# Altium schematic sheet GTM_MCU.SchDoc
size A4
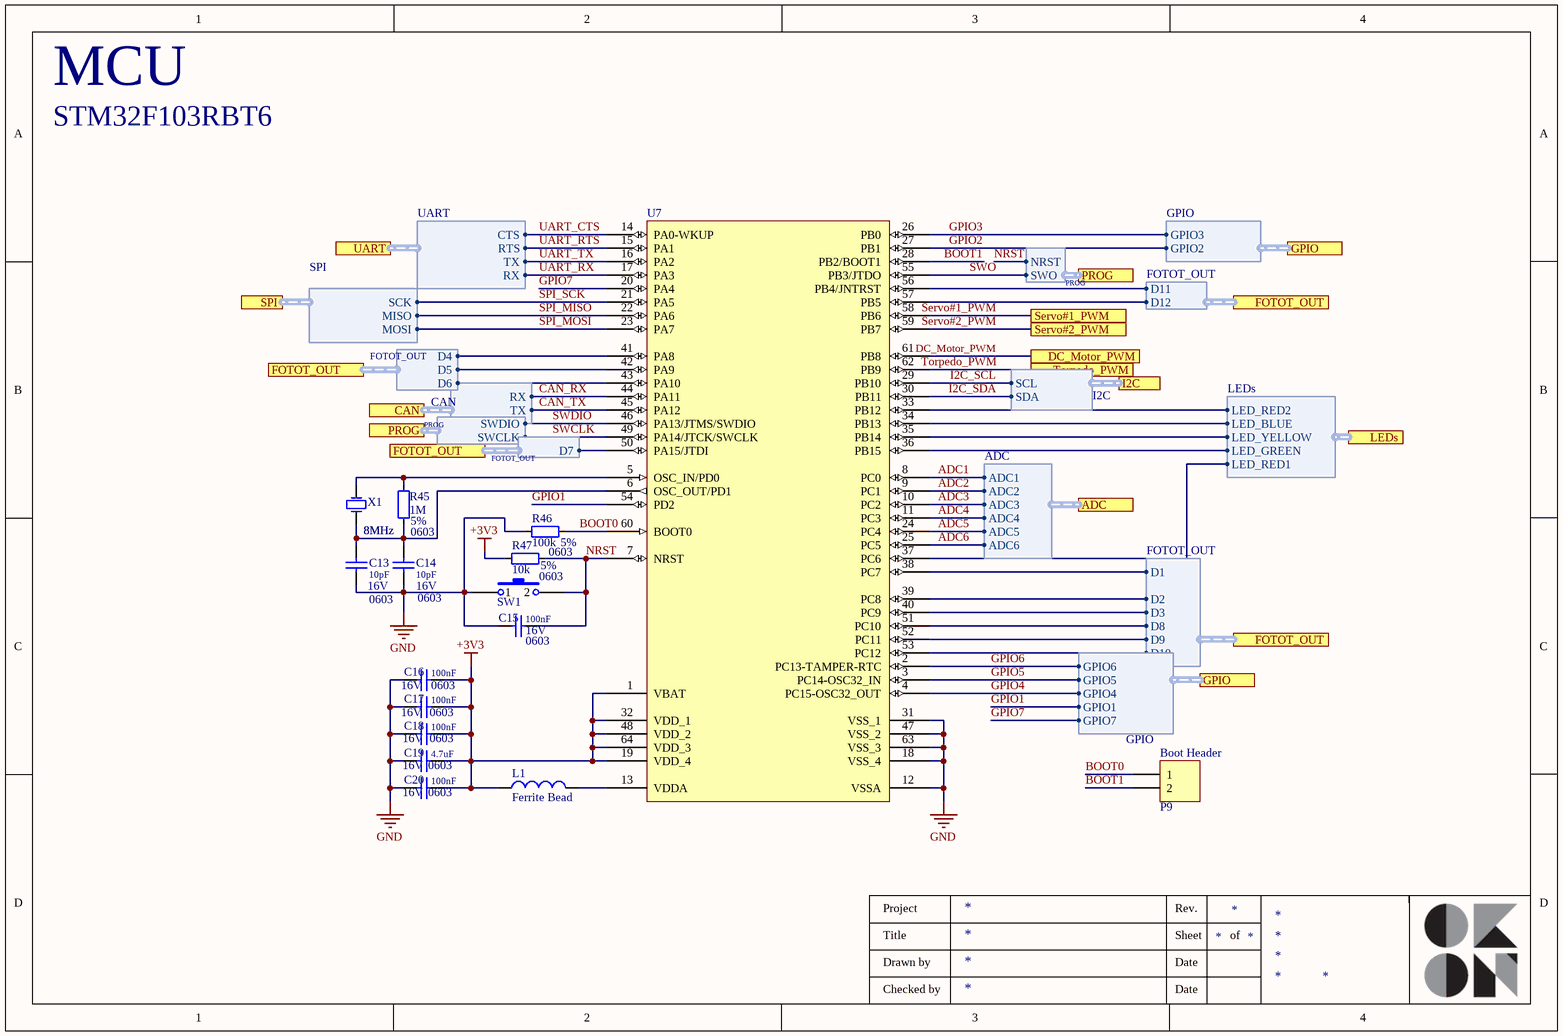
[diagram p0: GTM_MCU.SchDoc]

## Parts
C13  value 10pF  Capacity: 16V  Package: 0603  [0603_CAP]  (hidden comment: Cap)
C14  value 10pF  Capacity: 16V  Package: 0603  [0603_CAP]  (hidden comment: Cap)
C15  value 100nF  Capacity: 16V  Package: 0603  [0603_CAP]  (hidden comment: Cap)
C16  value 100nF  Capacity: 16V  Package: 0603  [0603_CAP]  (hidden comment: Cap)
C17  value 100nF  Capacity: 16V  Package: 0603  [0603_CAP]  (hidden comment: Cap)
C18  value 100nF  Capacity: 16V  Package: 0603  [0603_CAP]  (hidden comment: Cap)
C19  value 4.7uF  Capacity: 16V  Package: 0603  [0603_CAP]  (hidden comment: Cap)
C20  value 100nF  Capacity: 16V  Package: 0603  [0603_CAP]  (hidden comment: Cap)
L1  Ferrite Bead  [DO5040]
P9  Boot Header  [HDR1X2]
R45  Tolerance: 5%  [0603]  (hidden comment: 1M)
R46  Tolerance: 5%  [0603]  (hidden comment: 100k)
R47  Tolerance: 5%  [0603]  (hidden comment: 10k)
SW1  Micro_Switch  [Tact 34N-F]  (value not drawn)
U7  STM32F103RBT6  [LQFP64_L]  (value not drawn)
X1  8MHz  [HC49/4H_SMX]

## Ports
ADC (harness ADC), CAN (harness CAN), DC_Motor_PWM, FOTOT_OUT (harness FOTOT_OUT), GPIO (harness GPIO), I2C (harness I2C), LEDs (harness LEDs), PROG (harness PROG), Servo#1_PWM, Servo#2_PWM, SPI (harness SPI), Torpedo_PWM, UART (harness UART)

## Harnesses
LEDs: LED_RED1, LED_GREEN, LED_YELLOW, LED_BLUE, LED_RED2
FOTOT_OUT: D1, D2, D3, D8, D9, D10
UART: CTS, RTS, TX, RX
SPI: SCK, MISO, MOSI
CAN: RX, TX
I2C: SCL, SDA
ADC: ADC1, ADC2, ADC3, ADC4, ADC5, ADC6
PROG: SWCLK, SWDIO
PROG: SWO, NRST
GPIO: GPIO4, GPIO5, GPIO6, GPIO1, GPIO7
FOTOT_OUT: D4, D5, D6
FOTOT_OUT: D7
FOTOT_OUT: D12, D11
GPIO: GPIO2, GPIO3

## Nets
+3V3: C16.2 C17.2 C18.2 C19.2 C20.2 L1.1 R47.2 U7.1(VBAT) U7.19(VDD_4) U7.32(VDD_1) U7.48(VDD_2) U7.64(VDD_3)
GND: C13.1 C14.1 C15.1 C16.1 C17.1 C18.1 C19.1 C20.1 R46.2 SW1.1 U7.12(VSSA) U7.18(VSS_4) U7.31(VSS_1) U7.47(VSS_2) U7.63(VSS_3)
ADC1: U7.8(PC0) ; port ADC.ADC1
ADC2: U7.9(PC1) ; port ADC.ADC2
ADC3: U7.10(PC2) ; port ADC.ADC3
ADC4: U7.11(PC3) ; port ADC.ADC4
ADC5: U7.24(PC4) ; port ADC.ADC5
ADC6: U7.25(PC5) ; port ADC.ADC6
BOOT0: P9.1 R46.1 U7.60(BOOT0)
BOOT1: P9.2 U7.28(PB2/BOOT1)
CAN_RX: U7.44(PA11) ; port CAN.RX
CAN_TX: U7.45(PA12) ; port CAN.TX
DC_Motor_PWM: U7.61(PB8) ; port DC_Motor_PWM
GPIO1: U7.54(PD2) ; port GPIO.GPIO1
GPIO2: U7.27(PB1) ; port GPIO.GPIO2
GPIO3: U7.26(PB0) ; port GPIO.GPIO3
GPIO4: U7.4(PC15-OSC32_OUT) ; port GPIO.GPIO4
GPIO5: U7.3(PC14-OSC32_IN) ; port GPIO.GPIO5
GPIO6: U7.2(PC13-TAMPER-RTC) ; port GPIO.GPIO6
GPIO7: U7.20(PA4) ; port GPIO.GPIO7
I2C_SCL: U7.29(PB10) ; port I2C.SCL
I2C_SDA: U7.30(PB11) ; port I2C.SDA
NRST: C15.2 R47.1 SW1.2 U7.7(NRST) ; port PROG.NRST
Servo#1_PWM: U7.58(PB6) ; port Servo#1_PWM
Servo#2_PWM: U7.59(PB7) ; port Servo#2_PWM
SPI_MISO: U7.22(PA6) ; port SPI.MISO
SPI_MOSI: U7.23(PA7) ; port SPI.MOSI
SPI_SCK: U7.21(PA5) ; port SPI.SCK
SWCLK: U7.49(PA14/JTCK/SWCLK) ; port PROG.SWCLK
SWDIO: U7.46(PA13/JTMS/SWDIO) ; port PROG.SWDIO
SWO: U7.55(PB3/JTDO) ; port PROG.SWO
Torpedo_PWM: U7.62(PB9) ; port Torpedo_PWM
UART_CTS: U7.14(PA0-WKUP) ; port UART.CTS
UART_RTS: U7.15(PA1) ; port UART.RTS
UART_RX: U7.17(PA3) ; port UART.RX
UART_TX: U7.16(PA2) ; port UART.TX
NetC13_2: C13.2 C14.2 R45.1 U7.6(OSC_OUT/PD1) X1.1(OSC1)
NetL1_2: L1.2 U7.13(VDDA)
NetR45_2: R45.2 U7.5(OSC_IN/PD0) X1.2(OSC2)
NetU7_33: U7.33(PB12) ; port LEDs.LED_RED2
NetU7_34: U7.34(PB13) ; port LEDs.LED_BLUE
NetU7_35: U7.35(PB14) ; port LEDs.LED_YELLOW
NetU7_36: U7.36(PB15) ; port LEDs.LED_GREEN
NetU7_37: U7.37(PC6) ; port LEDs.LED_RED1
NetU7_38: U7.38(PC7) ; port FOTOT_OUT.D1
NetU7_39: U7.39(PC8) ; port FOTOT_OUT.D2
NetU7_40: U7.40(PC9) ; port FOTOT_OUT.D3
NetU7_41: U7.41(PA8) ; port FOTOT_OUT.D4
NetU7_42: U7.42(PA9) ; port FOTOT_OUT.D5
NetU7_43: U7.43(PA10) ; port FOTOT_OUT.D6
NetU7_50: U7.50(PA15/JTDI) ; port FOTOT_OUT.D7
NetU7_51: U7.51(PC10) ; port FOTOT_OUT.D8
NetU7_52: U7.52(PC11) ; port FOTOT_OUT.D9
NetU7_53: U7.53(PC12) ; port FOTOT_OUT.D10
NetU7_56: U7.56(PB4/JNTRST) ; port FOTOT_OUT.D11
NetU7_57: U7.57(PB5) ; port FOTOT_OUT.D12

## Notes on the sheet
- MCU
- STM32F103RBT6
- Project
- Rev.
- Title
- Drawn by
- Date
- Sheet
- of
- Checked by

## Library data of the parts
C13-C20 = Cap: Ceramic capacitor; Unit Price1: *; Unit Price2: *
L1 = Inductor: DO5040H-103; Code_IEC: 1005; Published: 8-Jun-2000; LatestRevisionDate: 29-May-2009; LatestRevisionNote: IPC-7351 Footprint Added.; PackageReference: 0402-A; Publisher: Altium Limited; PackageDescription: Chip Inductor; Code_JEITA: 0402
P9 = HDR1X2: Header, 2-Pin; LatestRevisionDate: 17-Jul-2002; LatestRevisionNote: Re-released for DXP Platform.; Publisher: Altium Limited
R45-R47 = RES: Resistior; Package: 0603
  R45: Value: 1M
  R46: Value: 100k
  R47: Value: 10k
SW1 = Micro_Switch: Switch; Published: 24-Mar-1999; LatestRevisionDate: 17-Jul-2002; LatestRevisionNote: Re-released for DXP Platform.; PackageReference: SPST-2; Publisher: Altium Limited
U7 = STM32F103RBT6: STM32 ARM-based 32-bit; Published: 30-May-2008; DatasheetVersion: rev6, Mar-2008; PackageVersion: Mar-2008; PackageReference: LQFP64; Publisher: Altium Limited; PackageDescription: 64-Pin Low-Profile Quad Flat Pack, 10 x 10 mm Body, 0.5 mm Pitch (LQFP64); ComponentLink1Description: Manufacturer Link; ComponentLink1URL: www.st.com/stm32; ComponentLink2Description: Datasheet; ComponentLink2URL: http://www.st.com/stonline/products/literature/ds/13587.pdf
X1 = XTAL: Oscillator; Unit Price1: *; Unit Price2: *; Value: 8MHz